# EAGLE design PSupply (EAGLE 5.11)
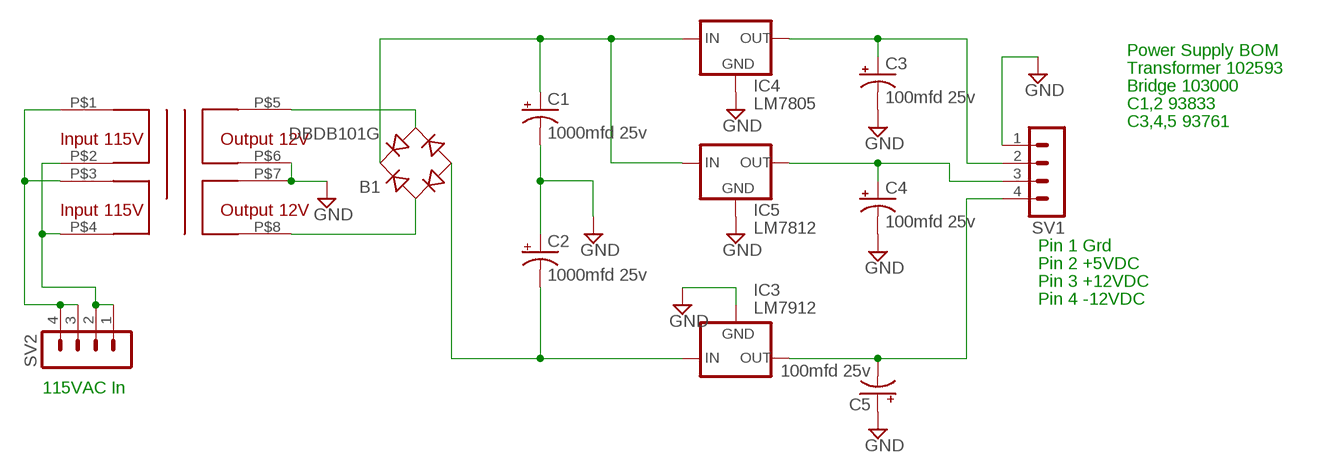
[diagram p0: schematic, sheet 1]

## Parts
B1  DBDB101G  [DB]
C1  1000mfd 25v  CPOL-USE5-10.5  [E5-10,5]
C2  1000mfd 25v  CPOL-USE5-10.5  [E5-10,5]
C3  100mfd 25v  CPOL-USE2.5-6  [E2,5-6]
C4  100mfd 25v  CPOL-USE2.5-6  [E2,5-6]
C5  100mfd 25v  CPOL-USE2.5-6  [E2,5-6]
IC3  LM7912  79XXS  [79XXS]
IC4  LM7805  78XXS  [78XXS]
IC5  LM7812  78XXS  [78XXS]
SV1  MA04-1  [MA04-1]
SV2  MA04-1  [MA04-1]
U$1  TRANS102593  [TRANS102593]

## Nets
GND: C1.- C2.+ C3.- C4.- C5.+ IC3.GND IC4.GND IC5.GND SV1.1 U$1.P$6 U$1.P$7
N$1: B1.+ C1.+ IC4.IN IC5.IN
N$3: B1.- C2.- IC3.IN
N$4: C3.+ IC4.OUT SV1.2
N$5: C5.- IC3.OUT SV1.4
N$6: C4.+ IC5.OUT SV1.3
N$7: B1.AC1 U$1.P$8
N$8: B1.AC2 U$1.P$5
N$11: SV2.3 SV2.4 U$1.P$1 U$1.P$3
N$12: SV2.1 SV2.2 U$1.P$2 U$1.P$4

## Notes on the sheet
- Power Supply BOM
- Transformer 102593
- Bridge 103000
- C1,2 93833
- C3,4,5 93761
- Pin 1 Grd
- Pin 2 +5VDC
- Pin 3 +12VDC
- Pin 4 -12VDC
- 115VAC In

## Library data of the parts
B1 = rectifier:DB?*G: Single Phase 1.0 AMP Glass Passivated Bridge Rectifier Taiwan Semiconductor Co.,Ltd. - TSC Source: http://www.taiwansemi.com/TSCbig5/ezcatfiles/cust/img/img/db101g.pdf http://www.ts.com.tw/db/pictures/modules/PDT/PDT060207001/DBLS201G.pdf
C1-C5 = resistor:CPOL-US: POLARIZED CAPACITOR, American symbol
IC3 = v-reg:79XXS: VOLTAGE REGULATOR
IC4 IC5 = v-reg:78XXS: VOLTAGE REGULATOR
SV1 SV2 = con-lstb:MA04-1: PIN HEADER; OC_FARNELL: unknown; OC_NEWARK: unknown
U$1 = DENS:TRANS102593

## Board
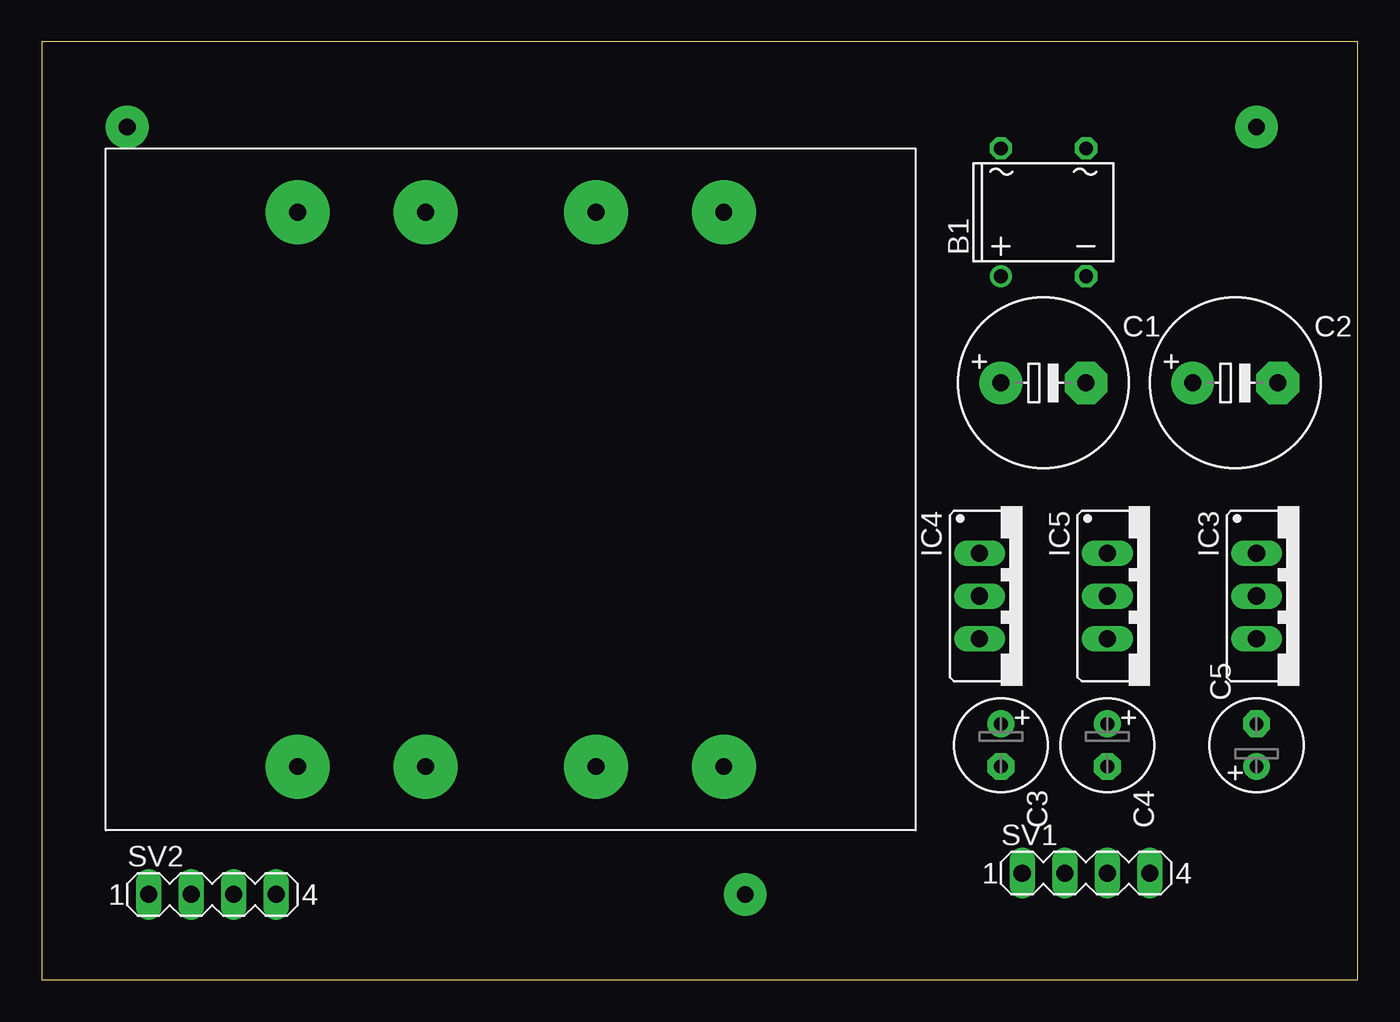
[diagram p1: board, top side]
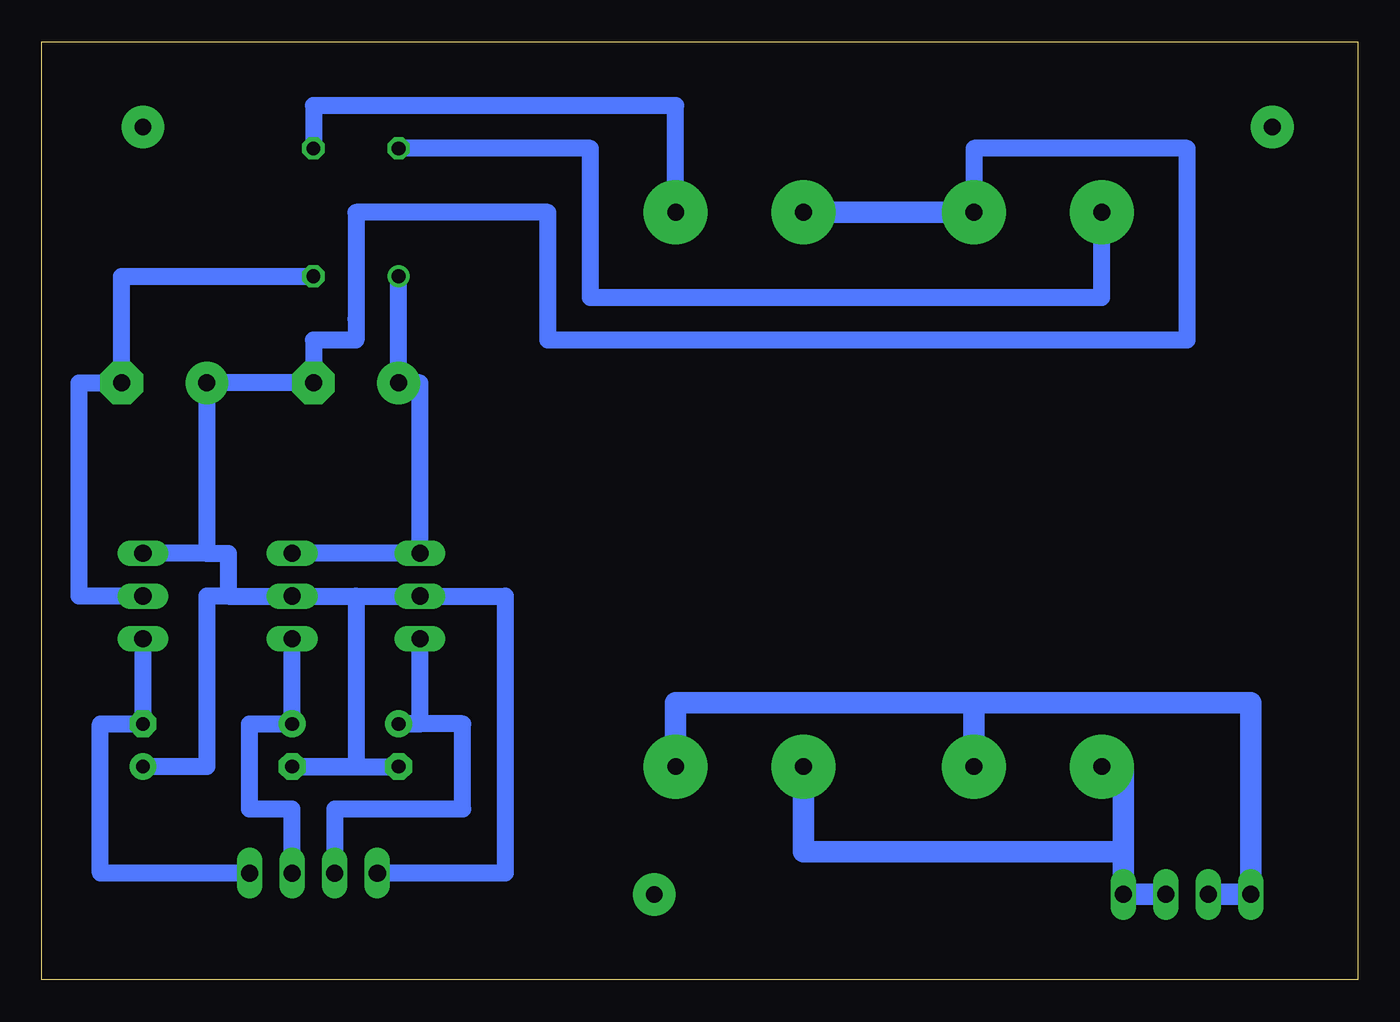
[diagram p2: board, bottom side, seen from below]

Size 78.41 x 55.87 mm. Coordinates in mm from the lower left corner, seen from the top.
Outline: 0,0 78.41,0 78.41,55.87 0,55.87 0,0
Copper layers (1*16): Top 0.035mm / dielectric 1.5mm / Bottom 0.035mm
Design rules "031mill": minimum track width 10mil, minimum drill 24mil, track to track 32mil, track to pad 32mil, pad to pad 32mil, via to via 32mil, smd to smd 32mil, copper to edge 40mil, drill to drill 8mil, minimum pad ring 10mil, minimum via ring 8mil, stop-mask expansion 4mil, vias tented up to drill 0mil, thermal gap 10mil

### Footprints (pad centres in the part's own frame; a part is rotated, then mirrored left to right if it is on the bottom)
DB = drill 0.813 round: + -2.54,-3.81 | drill 0.813 octagon: - 2.54,-3.81; AC1 2.54,3.81; AC2 -2.54,3.81
E5-10,5 = drill 1.016 pad 2.54 round: + -2.54,0 | drill 1.016 pad 2.54 octagon: - 2.54,0
E2,5-6 = drill 0.813 pad 1.6 round: + -1.27,0 | drill 0.813 pad 1.6 octagon: - 1.27,0
79XXS = drill 1.016 long: GND -2.54,-2.54; IN 0,-2.54; OUT 2.54,-2.54
78XXS = drill 1.016 long: GND 0,-2.54; IN -2.54,-2.54; OUT 2.54,-2.54
MA04-1 = drill 1.016 long: 1 -3.81,0; 2 -1.27,0; 3 1.27,0; 4 3.81,0
TRANS102593 = drill 1 pad 3.81 round: P$1 -16.51,12.7; P$2 -16.51,5.08; P$3 -16.51,-5.08; P$4 -16.51,-12.7; P$5 16.51,12.7; P$6 16.51,5.08; P$7 16.51,-5.08; P$8 16.51,-12.7

### Placement (x,y rotation side)
B1  59.69,45.72 0 top
C1  59.69,35.56 0 top
C2  71.12,35.56 0 top
C3  57.15,13.97 270 top
C4  63.5,13.97 270 top
C5  72.39,13.97 90 top
IC3  74.93,22.86 270 top
IC4  58.42,22.86 270 top
IC5  66.04,22.86 270 top
SV1  62.23,6.35 0 top
SV2  10.16,5.08 0 top
U$1  27.94,29.21 90 top

### Tracks (layer width: path | path; a pad name or v marks a point on that pad's centre or on a via)
GND
  Bottom 1.016: U$1.P$6 22.86,49.53 10.16,49.53 10.16,38.1 48.26,38.1 48.26,45.72 59.69,45.72 59.69,39.37 59.69,38.1 62.23,38.1 C1.- C2.+ 68.58,25.4 | C3.- C4.- 59.69,12.7 59.69,22.86 | 59.69,22.86 IC5.GND 67.31,22.86 | 59.69,22.86 IC4.GND 50.8,22.86 50.8,6.35 SV1.1 | 67.31,22.86 67.31,25.4 68.58,25.4 | 68.58,25.4 IC3.GND 68.58,25.4 | C5.+ 68.58,12.7 68.58,22.86 67.31,22.86
  Bottom 1.27: U$1.P$6 U$1.P$7
N$1
  Bottom 1.016: B1.+ C1.+ 55.88,35.56 IC4.IN IC5.IN
N$2  (via drill 1 pad 2.54)
  other vias: 5.08,50.8
N$3
  Bottom 1.016: B1.- 73.66,41.91 C2.- 76.2,35.56 76.2,22.86 IC3.IN
N$4
  Bottom 1.016: IC4.OUT 55.88,15.24 C3.+ 53.34,15.24 53.34,10.16 60.96,10.16 60.96,8.89 SV1.2
N$5
  Bottom 1.016: SV1.4 74.93,6.35 74.93,15.24 C5.- IC3.OUT
N$6
  Bottom 1.016: IC5.OUT C4.+ 66.04,15.24 66.04,10.16 63.5,10.16 SV1.3
N$7
  Bottom 1.016: U$1.P$8 40.64,52.07 62.23,52.07 B1.AC1
N$8
  Bottom 1.016: U$1.P$5 15.24,40.64 45.72,40.64 45.72,49.53 B1.AC2
N$9  (via drill 1 pad 2.54)
  other vias: 72.39,50.8
N$10  (via drill 1 pad 2.54)
  other vias: 41.91,5.08
N$11
  Bottom 1.27: U$1.P$1 13.97,12.7 13.97,7.62 | 13.97,7.62 SV2.4 SV2.3 | U$1.P$3 33.02,7.62 13.97,7.62
N$12
  Bottom 1.27: U$1.P$4 40.64,16.51 22.86,16.51 | 22.86,16.51 U$1.P$2 22.86,16.51 | 22.86,16.51 6.35,16.51 6.35,15.24 SV2.1 SV2.2